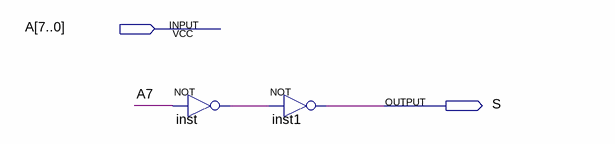
[diagram p0: schematic sheet]
// Quartus schematic Negativo.bdf as structural Verilog: 2 symbols, 2 pins
module Negativo (
  input  [7:0] A,
  output S
);

  wire inst_out;

  not inst (inst_out, A[7]);
  not inst1 (S, inst_out);
endmodule
